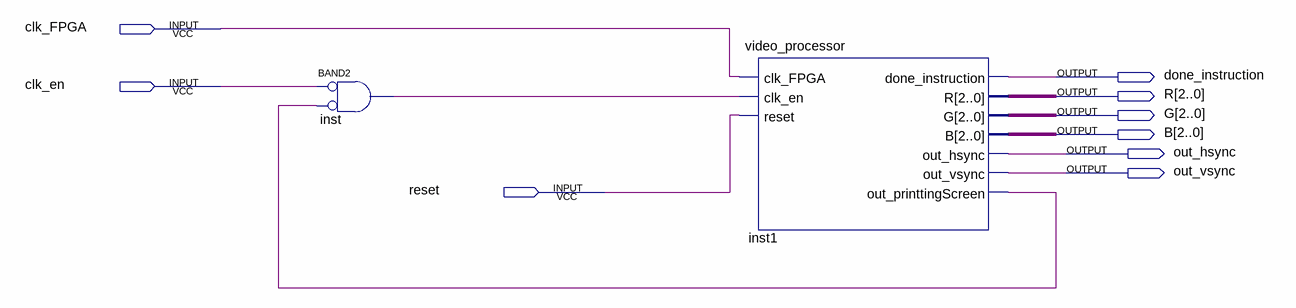
[diagram p0: schematic sheet]
// Quartus schematic ConsoleFPGA.bdf as structural Verilog: 2 symbols, 9 pins
module ConsoleFPGA (
  input  clk_FPGA,
  input  clk_en,
  input  reset,
  output done_instruction,
  output [2:0] R,
  output [2:0] G,
  output [2:0] B,
  output out_hsync,
  output out_vsync
);

  wire inst1_out_printtingscreen, inst_out;

  and inst (inst_out, ~clk_en, ~inst1_out_printtingscreen);  // BAND2
  video_processor inst1 (
    .clk_FPGA(clk_FPGA), .clk_en(inst_out), .reset(reset), .done_instruction(done_instruction), .R(R), .G(G),
    .B(B), .out_hsync(out_hsync), .out_vsync(out_vsync), .out_printtingScreen(inst1_out_printtingscreen));
endmodule
